# Altium schematic sheet Sheet1.SchDoc
size A2
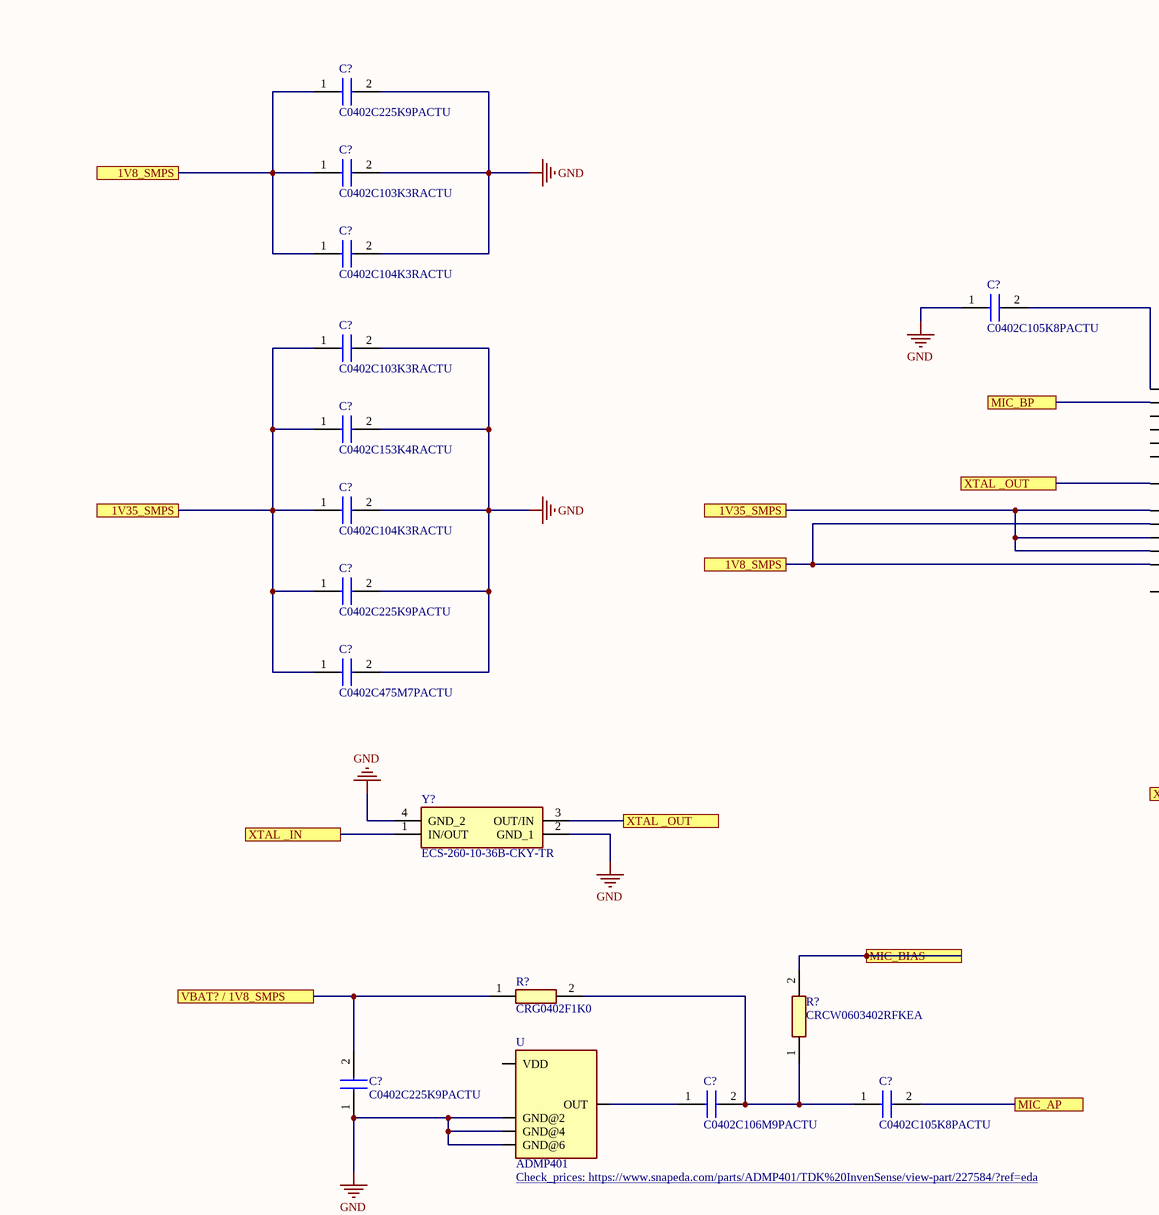
[diagram p0: Sheet1.SchDoc, top left]
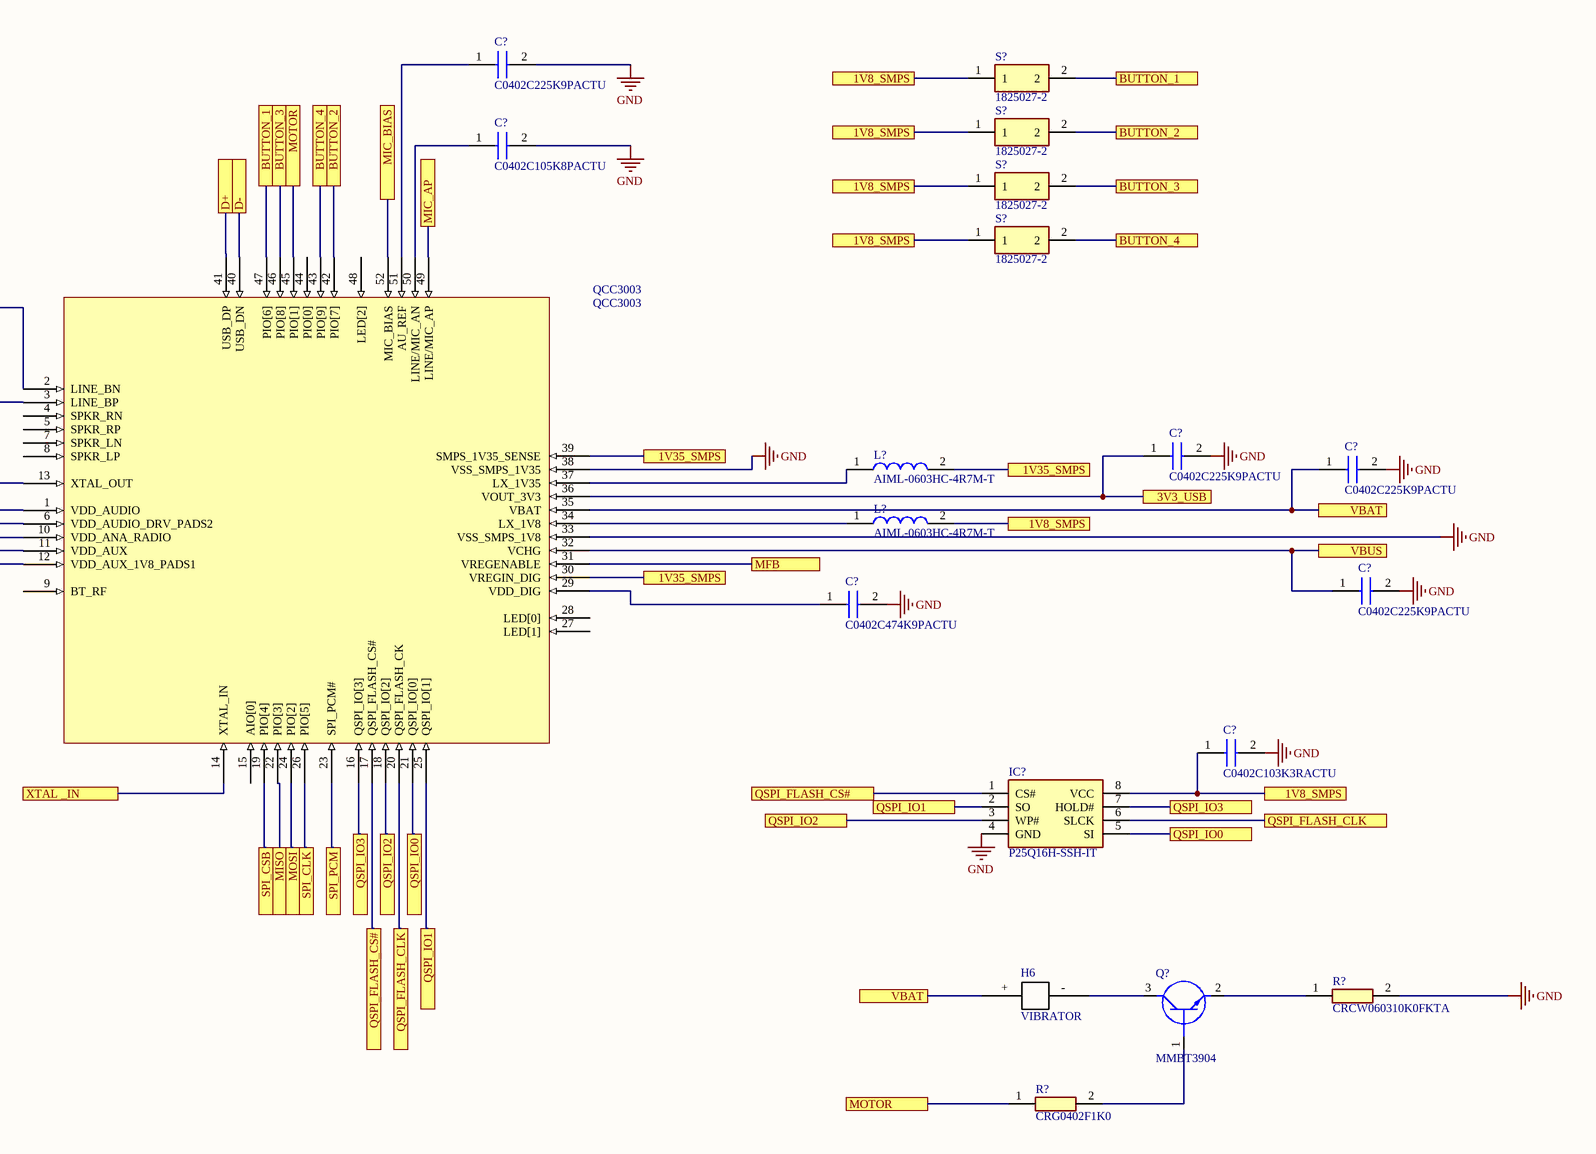
[diagram p1: Sheet1.SchDoc, top right]
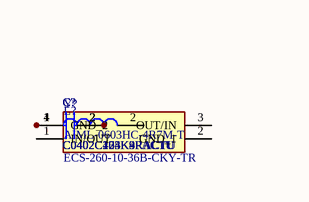
[diagram p2: Sheet1.SchDoc, bottom left]

## Parts
(Parts that share a designator on the sheet are numbered #1, #2 ... from top to bottom, then left to right.)
C?#1  C0402C225K9PACTU  [CAPC1005X55N]
C?#2  C0402C225K9PACTU  [CAPC1005X55N]
C?#3  C0402C105K8PACTU  [CAPC1005X55N]
C?#4  C0402C103K3RACTU  [CAPC1005X55N]
C?#5  C0402C104K3RACTU  [CAPC1005X55N]
C?#6  C0402C105K8PACTU  [CAPC1005X55N]
C?#7  C0402C103K3RACTU  [CAPC1005X55N]
C?#8  C0402C153K4RACTU  [CAPC1005X55N]
C?#9  C0402C225K9PACTU  [CAPC1005X55N]
C?#10  C0402C225K9PACTU  [CAPC1005X55N]
C?#11  C0402C104K3RACTU  [CAPC1005X55N]
C?#12  C0402C225K9PACTU  [CAPC1005X55N]
C?#13  C0402C225K9PACTU  [CAPC1005X55N]
C?#14  C0402C474K9PACTU  [CAPC1005X55N]
C?#15  C0402C475M7PACTU  [CAPC1005X65N]
C?#16  C0402C103K3RACTU  [CAPC1005X55N]
C?#17  C0402C106M9PACTU  [CAPC1005X55N]
C?#18  C0402C105K8PACTU  [CAPC1005X55N]
C?#19  C0402C225K9PACTU  [CAPC1005X55N]
C?#20  C0402C225K9PACTU  [CAPC1005X55N]
C?#21  C0402C104K3RACTU  [CAPC1005X55N]
C?#22  C0402C103K3RACTU  [CAPC1005X55N]
C?#23  C0402C153K4RACTU  [CAPC1005X55N]
C?#24  C0402C474K9PACTU  [CAPC1005X55N]
H6  VIBRATOR
IC?  P25Q16H-SSH-IT  [SOIC127P600X175-8N]
L?#1  AIML-0603HC-4R7M-T  [INDC1608X95N]
L?#2  AIML-0603HC-4R7M-T  [INDC1608X95N]
L?#3  AIML-0603HC-4R7M-T  [INDC1608X95N]
Q?  MMBT3904  [SOT95P240X120-3N]
QCC3003  QCC3003  [QFN40P600X600X60]
R?#1  CRG0402F1K0  [RESC1005X40N]
R?#2  CRCW060310K0FKTA  [RESC1608X50N]
R?#3  CRCW0603402RFKEA  [RESC1608X50N]
R?#4  CRG0402F1K0  [RESC1005X40N]
S?#1  1825027-2  [1825027-2]
S?#2  1825027-2  [1825027-2]
S?#3  1825027-2  [1825027-2]
S?#4  1825027-2  [1825027-2]
U  ADMP401  [ADMP401]
Y?#1  ECS-260-10-36B-CKY-TR  [ECS240836QAESTR]
Y?#2  ECS-260-10-36B-CKY-TR  [ECS240836QAESTR]

## Ports
1V8_SMPS, 1V35_SMPS, 3V3_USB, BUTTON_1, BUTTON_2, BUTTON_3, BUTTON_4, D+, D-, MFB, MIC_AP, MIC_BIAS, MIC_BP, MISO, MOSI, MOTOR, QSPI_FLASH_CLK, QSPI_FLASH_CS#, QSPI_IO0, QSPI_IO1, QSPI_IO2, QSPI_IO3, SPI_CLK, SPI_CSB, SPI_PCM, VBAT, VBAT? / 1V8_SMPS, VBUS, XTAL _IN, XTAL _OUT

## Nets
GND: C?#1.2 C?#2.2 C?#3.2 C?#4.2 C?#5.2 C?#6.1 C?#7.2 C?#8.2 C?#9.2 C?#10.2 C?#11.2 C?#12.2 C?#13.2 C?#14.2 C?#15.2 C?#16.2 C?#19.1 IC?.4(GND) QCC3003.33(VSS_SMPS_1V8) QCC3003.38(VSS_SMPS_1V35) R?#2.2 U.2(GND@2) U.4(GND@4) U.6(GND@6) Y?#1.2(GND_1) Y?#1.4(GND_2)
1V8_SMPS: C?#2.1 C?#4.1 C?#5.1 C?#16.1 IC?.8(VCC) L?#2.2 QCC3003.6(VDD_AUDIO_DRV_PADS2) QCC3003.12(VDD_AUX_1V8_PADS1) S?#1.1 S?#2.1 S?#3.1 S?#4.1 ; port 1V8_SMPS
1V35_SMPS: C?#7.1 C?#8.1 C?#11.1 C?#12.1 C?#15.1 L?#1.2 QCC3003.1(VDD_AUDIO) QCC3003.10(VDD_ANA_RADIO) QCC3003.11(VDD_AUX) QCC3003.30(VREGIN_DIG) QCC3003.39(SMPS_1V35_SENSE) ; port 1V35_SMPS
3V3_USB: C?#9.1 QCC3003.36(VOUT_3V3) ; port 3V3_USB
BUTTON_1: QCC3003.47(PIO[6]) S?#1.2 ; port BUTTON_1
BUTTON_2: QCC3003.42(PIO[7]) S?#2.2 ; port BUTTON_2
BUTTON_3: QCC3003.46(PIO[8]) S?#3.2 ; port BUTTON_3
BUTTON_4: QCC3003.43(PIO[9]) S?#4.2 ; port BUTTON_4
D+: QCC3003.41(USB_DP) ; port D+
D-: QCC3003.40(USB_DN) ; port D-
MFB: QCC3003.31(VREGENABLE) ; port MFB
MIC_AP: C?#18.2 QCC3003.49(LINE/MIC_AP) ; port MIC_AP
MIC_BIAS: QCC3003.52(MIC_BIAS) R?#3.2 ; port MIC_BIAS
MIC_BP: QCC3003.3(LINE_BP) ; port MIC_BP
MISO: QCC3003.22(PIO[3]) ; port MISO
MOSI: QCC3003.24(PIO[2]) ; port MOSI
MOTOR: QCC3003.45(PIO[1]) R?#4.1 ; port MOTOR
QSPI_FLASH_CLK: IC?.6(SLCK) QCC3003.20(QSPI_FLASH_CK) ; port QSPI_FLASH_CLK
QSPI_FLASH_CS#: IC?.1(CS#) QCC3003.17(QSPI_FLASH_CS#) ; port QSPI_FLASH_CS#
QSPI_IO0: IC?.5(SI) QCC3003.21(QSPI_IO[0]) ; port QSPI_IO0
QSPI_IO1: IC?.2(SO) QCC3003.25(QSPI_IO[1]) ; port QSPI_IO1
QSPI_IO2: IC?.3(WP#) QCC3003.18(QSPI_IO[2]) ; port QSPI_IO2
QSPI_IO3: IC?.7(HOLD#) QCC3003.16(QSPI_IO[3]) ; port QSPI_IO3
SPI_CLK: QCC3003.26(PIO[5]) ; port SPI_CLK
SPI_CSB: QCC3003.19(PIO[4]) ; port SPI_CSB
SPI_PCM: QCC3003.23(SPI_PCM#) ; port SPI_PCM
VBAT: C?#10.1 H6.+ QCC3003.35(VBAT) ; port VBAT
VBAT? / 1V8_SMPS: C?#19.2 R?#1.1 ; port VBAT? / 1V8_SMPS
VBUS: C?#13.1 QCC3003.32(VCHG) ; port VBUS
XTAL _IN: QCC3003.14(XTAL_IN) Y?#1.1(IN/OUT) ; port XTAL _IN
XTAL _OUT: QCC3003.13(XTAL_OUT) Y?#1.3(OUT/IN) ; port XTAL _OUT
NetC?#1_1: C?#1.1 QCC3003.51(AU_REF)
NetC?#3_1: C?#3.1 QCC3003.50(LINE/MIC_AN)
NetC?#6_2: C?#6.2 QCC3003.2(LINE_BN)
NetC?#14_1: C?#14.1 QCC3003.29(VDD_DIG)
NetC?#17_1: C?#17.1 U.1(OUT)
NetC?#17_2: C?#17.2 C?#18.1 R?#1.2 R?#3.1
NetC?#20_1: C?#20.1 C?#21.1 C?#22.1 C?#23.1 C?#24.1 L?#3.1 Y?#2.4(GND_2)
NetC?#20_2: C?#20.2 C?#21.2 C?#22.2 C?#23.2 C?#24.2
NetH6_-: H6.- Q?.3(C)
NetL?#1_1: L?#1.1 QCC3003.37(LX_1V35)
NetL?#2_1: L?#2.1 QCC3003.34(LX_1V8)
NetQ?_1: Q?.1(B) R?#4.2
NetQ?_2: Q?.2(E) R?#2.1

Not connected (* = marked no-connect by the designer): L?#3 2; QCC3003 4(SPKR_RN) 5(SPKR_RP) 7(SPKR_LN) 8(SPKR_LP) 9(BT_RF) 15(AIO[0]) 27(LED[1]) 28(LED[0]) 44(PIO[0]) 48(LED[2]); U 5(VDD); Y?#2 1(IN/OUT) 2(GND_1) 3(OUT/IN)

## Library data of the parts
C?#1 C?#2 C?#9 C?#10 C?#12 C?#13 C?#19 C?#20 = C0402C225K9PACTU: Capacitor; Manufacturer_Name: Kemet; Datasheet Link: https://content.kemet.com/datasheets/KEM_C1002_X7R_SMD.pdf; Height: 0.55mm; Manufacturer_Part_Number: C0402C225K9PACTU; Arrow Part Number: C0402C225K9PACTU; Arrow Price/Stock: https://www.arrow.com/en/products/c0402c225k9pactu/kemet-corporation; Mouser Part Number: 80-C0402C225K9P; Mouser Price/Stock: https://www.mouser.com/Search/Refine.aspx?Keyword=80-C0402C225K9P
C?#3 C?#6 C?#18 = C0402C105K8PACTU: Capacitor; Manufacturer_Name: Kemet; Datasheet Link: https://componentsearchengine.com/Datasheets/2/C0402C105K8PACTU.pdf; Height: 0.55mm; Manufacturer_Part_Number: C0402C105K8PACTU; Arrow Part Number: C0402C105K8PACTU; Arrow Price/Stock: https://www.arrow.com/en/products/c0402c105k8pactu/kemet-corporation; Mouser Part Number: 80-C0402C105K8P; Mouser Price/Stock: https://www.mouser.co.uk/ProductDetail/KEMET/C0402C105K8PACTU?qs=KHg1sw%2FVM5SU8%252B2legsmYQ%3D%3D
C?#4 C?#7 C?#16 C?#22 = C0402C103K3RACTU: Capacitor; Manufacturer_Name: Kemet; Datasheet Link: https://componentsearchengine.com/Datasheets/2/C0402C103K3RACTU.pdf; Height: 0.55mm; Manufacturer_Part_Number: C0402C103K3RACTU; Arrow Part Number: C0402C103K3RACTU; Arrow Price/Stock: https://www.arrow.com/en/products/c0402c103k3ractu/kemet-corporation; Mouser Part Number: 80-C0402C103K3R; Mouser Price/Stock: https://www.mouser.co.uk/ProductDetail/KEMET/C0402C103K3RACTU?qs=A9KPa1hU2BRD%252BYWIRO5N9g%3D%3D
C?#5 C?#11 C?#21 = C0402C104K3RACTU: Capacitor; Manufacturer_Name: Kemet; Datasheet Link: http://uk.rs-online.com/web/p/products/1213875; Height: 0.55mm; Manufacturer_Part_Number: C0402C104K3RACTU; Arrow Part Number: C0402C104K3RACTU; Arrow Price/Stock: https://www.arrow.com/en/products/c0402c104k3ractu/kemet-corporation; Mouser Part Number: 80-C0402C104K3R; Mouser Price/Stock: https://www.mouser.co.uk/ProductDetail/KEMET/C0402C104K3RACTU?qs=YCcZ0GhAU2q7BaxZ%2FluQHA%3D%3D
C?#8 C?#23 = C0402C153K4RACTU: Capacitor; Manufacturer_Name: Kemet; Datasheet Link: https://content.kemet.com/datasheets/KEM_C1002_X7R_SMD.pdf; Height: 0.55mm; Manufacturer_Part_Number: C0402C153K4RACTU
C?#14 C?#24 = C0402C474K9PACTU: Capacitor; Manufacturer_Name: Kemet; Datasheet Link: https://content.kemet.com/datasheets/KEM_C1002_X7R_SMD.pdf; Height: 0.55mm; Manufacturer_Part_Number: C0402C474K9PACTU; Arrow Part Number: C0402C474K9PACTU; Arrow Price/Stock: https://www.arrow.com/en/products/c0402c474k9pactu/kemet-corporation; Mouser Part Number: 80-C0402C474K9P; Mouser Price/Stock: https://www.mouser.co.uk/ProductDetail/KEMET/C0402C474K9PACTU?qs=KHg1sw%2FVM5RivoKJ3oVJkQ%3D%3D
C?#15 = C0402C475M7PACTU: Capacitor; Manufacturer_Name: Kemet; Datasheet Link: https://content.kemet.com/datasheets/KEM_C1006_X5R_SMD.pdf; Height: 0.65mm; Manufacturer_Part_Number: C0402C475M7PACTU; Mouser Part Number: 80-C0402C475M7P; Mouser Price/Stock: http://www.mouser.com/Search/ProductDetail.aspx?qs=SzIX745sIXFB9Q9KfZhc4g%3d%3d
C?#17 = C0402C106M9PACTU: Capacitor; Manufacturer_Name: Kemet; Datasheet Link: https://componentsearchengine.com/Datasheets/2/C0402C106M9PACTU.pdf; Height: 0.55mm; Manufacturer_Part_Number: C0402C106M9PACTU; Arrow Part Number: C0402C106M9PACTU; Arrow Price/Stock: https://www.arrow.com/en/products/c0402c106m9pactu/kemet-corporation; Mouser Part Number: 80-C0402C106M9P; Mouser Price/Stock: https://www.mouser.co.uk/ProductDetail/KEMET/C0402C106M9PACTU?qs=x4XeXhDQKnp%252Bz0lMlwMC3A%3D%3D
IC? = P25Q16H-SSH-IT: Integrated Circuit; Manufacturer_Name: PUYA; Datasheet Link: https://lcsc.com/product-detail/FLASH_PUYA-P25Q16H-SSH-IT_C194871.html; Height: 1.75mm; Manufacturer_Part_Number: P25Q16H-SSH-IT
L?#1-L?#3 = AIML-0603HC-4R7M-T: Inductor; Manufacturer_Name: ABRACON; Datasheet Link: https://componentsearchengine.com/Datasheets/1/AIML-0603HC-4R7M-T.pdf; Height: 0.95mm; Manufacturer_Part_Number: AIML-0603HC-4R7M-T; Mouser Part Number: 815-AIML-0603HC4R7MT; Mouser Price/Stock: https://www.mouser.com/Search/Refine.aspx?Keyword=815-AIML-0603HC4R7MT
Q? = MMBT3904: Transistor BJT NPN; Manufacturer_Name: ON Semiconductor; Datasheet Link: https://media.digikey.com/pdf/Data%20Sheets/ON%20Semiconductor%20PDFs/2N3904,MMBT3904,PZT3904.pdf; Height: 1.2mm; Manufacturer_Part_Number: MMBT3904; Arrow Part Number: MMBT3904; Arrow Price/Stock: https://www.arrow.com/en/products/mmbt3904/on-semiconductor; Mouser Part Number: 512-MMBT3904; Mouser Price/Stock: https://www.mouser.co.uk/ProductDetail/ON-Semiconductor-Fairchild/MMBT3904?qs=UMEuL5FsraCg3xKjS4uBJQ%3D%3D
R?#1 R?#4 = CRG0402F1K0: Resistor; Manufacturer_Name: TE Connectivity; Datasheet Link: http://docs-europe.electrocomponents.com/webdocs/13d1/0900766b813d116f.pdf; Height: 0.4mm; Manufacturer_Part_Number: CRG0402F1K0; Arrow Part Number: CRG0402F1K0; Arrow Price/Stock: https://www.arrow.com/en/products/crg0402f1k0/te-connectivity; Mouser Part Number: 279-CRG0402F1K0; Mouser Price/Stock: https://www.mouser.com/Search/Refine.aspx?Keyword=279-CRG0402F1K0
R?#2 = CRCW060310K0FKTA: Resistor; Manufacturer_Name: Vishay; Datasheet Link: http://www.vishay.com/docs/20035/dcrcwe3.pdf; Height: 0.5mm; Manufacturer_Part_Number: CRCW060310K0FKTA; Arrow Part Number: CRCW060310K0FKTA; Arrow Price/Stock: https://www.arrow.com/en/products/crcw060310k0fkta/vishay; Mouser Part Number: 71-CRCW0603-10K; Mouser Price/Stock: https://www.mouser.co.uk/ProductDetail/Vishay-Dale/CRCW060310K0FKTA?qs=Gr34wKER0gV5SJ3RxaDljg%3D%3D
R?#3 = CRCW0603402RFKEA: Resistor; Manufacturer_Name: Vishay; Datasheet Link: http://www.vishay.com/docs/20035/dcrcwe3.pdf; Height: 0.5mm; Manufacturer_Part_Number: CRCW0603402RFKEA; Arrow Part Number: CRCW0603402RFKEA; Arrow Price/Stock: https://www.arrow.com/en/products/crcw0603402rfkea/vishay; Mouser Part Number: 71-CRCW0603-402-E3; Mouser Price/Stock: https://www.mouser.co.uk/ProductDetail/Vishay-Dale/CRCW0603402RFKEA?qs=PlgT7GGookHxID%2FOfdNhwg%3D%3D
S?#1-S?#4 = 1825027-2: Switch; Manufacturer_Name: TE Connectivity; Datasheet Link: http://www.te.com/commerce/DocumentDelivery/DDEController?Action=showdoc&DocId=Customer+Drawing%7F1825027%7FG4%7Fpdf%7FEnglish%7FENG_CD_1825027_G4.pdf%7F1825027-2; Manufacturer_Part_Number: 1825027-2; Arrow Part Number: 1825027-2; Arrow Price/Stock: https://www.arrow.com/en/products/1825027-2/te-connectivity; Mouser Part Number: 506-1825027-2; Mouser Price/Stock: https://www.mouser.co.uk/ProductDetail/TE-Connectivity-PB/1825027-2?qs=QZe2IbIN4jcDAqlEbjMPrg%3D%3D
U = ADMP401: 60Hz ~ 15kHz Analog Microphone MEMS (Silicon) 1.5V ~ 3.3V Omnidirectional (-42dB Â±3dB @ 94dB SPL) Solder Pads; MF: TDK InvenSense; MP: ADMP401; Price: None; Availability: Unavailable; SnapEDA_Link: https://www.snapeda.com/parts/ADMP401/TDK%20InvenSense/view-part/227584/?ref=snap; Value: *; Package: None; Check_prices: https://www.snapeda.com/parts/ADMP401/TDK%20InvenSense/view-part/227584/?ref=eda
Y?#1 Y?#2 = ECS-260-10-36B-CKY-TR: Crystal or Oscillator; Manufacturer_Name: ECS; Datasheet Link: https://ecsxtal.com/store/pdf/ECX-2236B.pdf; Height: 0mm; Manufacturer_Part_Number: ECS-260-10-36B-CKY-TR; Arrow Part Number: ECS-260-10-36B-CKY-TR; Arrow Price/Stock: https://www.arrow.com/en/products/ecs-260-10-36b-cky-tr/ecs-international; Mouser Part Number: 520-260-10-36B-CKYT; Mouser Price/Stock: https://www.mouser.com/Search/Refine.aspx?Keyword=520-260-10-36B-CKYT